# EasyEDA Pro project b6s.eprj, schematic Schematic2
Board Name: B5S_20A; Create Date: 2026-02-02; Page Name: P1; Project Name: b6s; Schematic Name: Schematic2; Update Date: 2026-02-08; Add into BOM: yes; Convert to PCB: yes
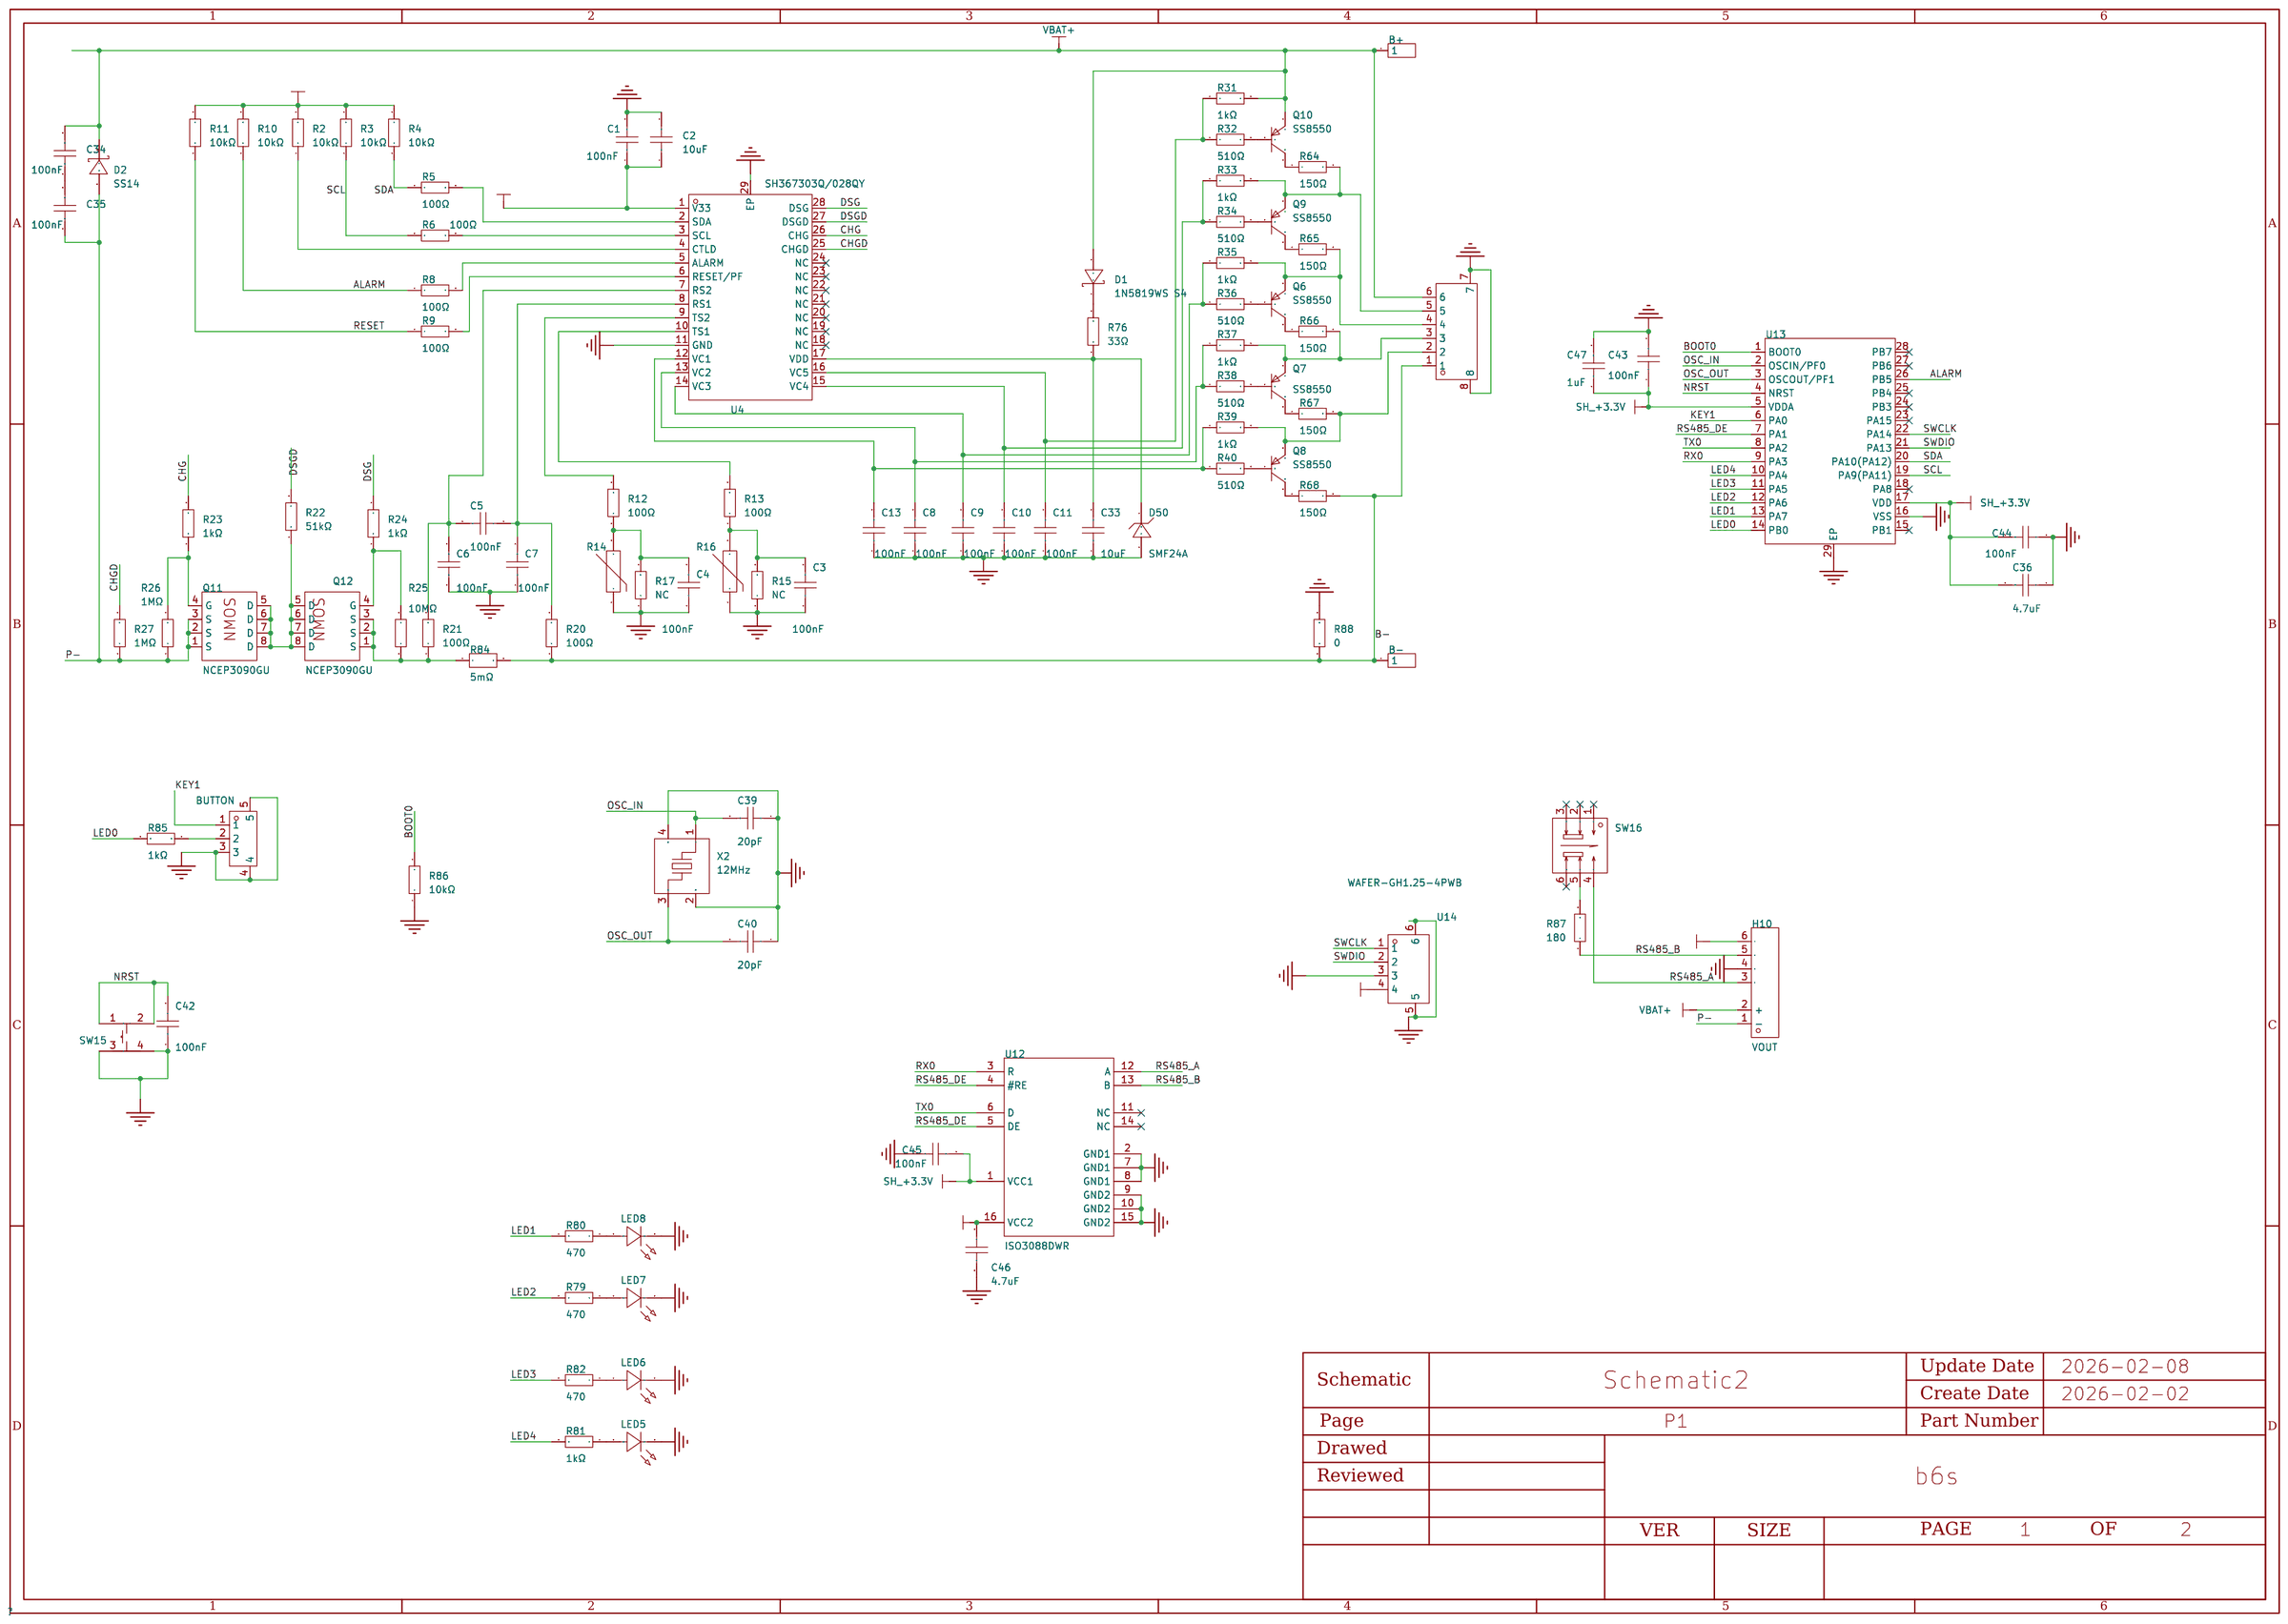
[diagram p1: schematic sheet]

## Parts
B+  -  [Wire_14AWG]
B-  -  [Wire_14AWG]
BUTTON  WAFER-GH1.25-3PLB  [CONN-SMD_3P-P1.25_XUNPU_WAFER-GH1.25-3PLB]
C1  100nF  [C0603]
C2  10uF  [C0603]
C3  100nF  [C0603]
C4  100nF  [C0603]
C5  100nF  [C0603]
C6  100nF  [C0603]
C7  100nF  [C0603]
C8  100nF  [C0603]
C9  100nF  [C0603]
C10  100nF  [C0603]
C11  100nF  [C0603]
C13  100nF  [C0603]
C33  10uF  [C0805]
C34  100nF  [C0603]
C35  100nF  [C0603]
C36  4.7uF  [C0603]
C39  20pF  [C0603]
C40  20pF  [C0603]
C42  100nF  [C0603]
C43  100nF  [C0603]
C44  100nF  [C0603]
C45  100nF  [C0603]
C46  4.7uF  [C0603]
C47  1uF  [C0603]
D1  1N5819WS S4  [SOD-323_L1.6-W1.3-LS2.7-RD]
D2  SS14  [SMA_L4.2-W2.6-LS5.0-RD_1]
D50  SMF24A  [SOD-123FL_L2.7-W1.8-LS3.8-RD]
H10  VOUT  [AMSS_XT60_2+4]
LED5  XL-257UBC-L  [LED-TH_L5.0-W2.5-P2.54-FD_GREEN_XL-257SYGD-L]
LED6  XL-257UBC-L  [LED-TH_L5.0-W2.5-P2.54-FD_GREEN_XL-257SYGD-L]
LED7  XL-257UBC-L  [LED-TH_L5.0-W2.5-P2.54-FD_GREEN_XL-257SYGD-L]
LED8  XL-257UBC-L  [LED-TH_L5.0-W2.5-P2.54-FD_GREEN_XL-257SYGD-L]
Q6  SS8550  [SOT-23-3_L2.9-W1.3-P1.90-LS2.4-BR]
Q7  SS8550  [SOT-23-3_L2.9-W1.3-P1.90-LS2.4-BR]
Q8  SS8550  [SOT-23-3_L2.9-W1.3-P1.90-LS2.4-BR]
Q9  SS8550  [SOT-23-3_L2.9-W1.3-P1.90-LS2.4-BR]
Q10  SS8550  [SOT-23-3_L2.9-W1.3-P1.90-LS2.4-BR]
Q11  NCEP3090GU  [DFN-8_L5.8-W4.9-P1.27-LS6.1-BL-2]
Q12  NCEP3090GU  [DFN-8_L5.8-W4.9-P1.27-LS6.1-BL-2]
R2  10kΩ  [R0603]
R3  10kΩ  [R0603]
R4  10kΩ  [R0603]
R5  100Ω  [R0603]
R6  100Ω  [R0603]
R8  100Ω  [R0603]
R9  100Ω  [R0603]
R10  10kΩ  [R0603]
R11  10kΩ  [R0603]
R12  100Ω  [R0603]
R13  100Ω  [R0603]
R14  MF52A103F3950 (A1)  [RES-TH_L2.5-W2.5-P1.70-D0.3]
R15  NC  [R0603]
R16  MF52A103F3950 (A1)  [RES-TH_L2.5-W2.5-P1.70-D0.3]
R17  NC  [R0603]
R20  100Ω  [R0603]
R21  100Ω  [R0603]
R22  51kΩ  [R0603]
R23  1kΩ  [R0603]
R24  1kΩ  [R0603]
R25  10MΩ  [R0603]
R26  1MΩ  [R0603]
R27  1MΩ  [R0603]
R31  1kΩ  [R0603]
R32  510Ω  [R0603]
R33  1kΩ  [R0603]
R34  510Ω  [R0603]
R35  1kΩ  [R0603]
R36  510Ω  [R0603]
R37  1kΩ  [R0603]
R38  510Ω  [R0603]
R39  1kΩ  [R0603]
R40  510Ω  [R0603]
R64  150Ω  [R1206]
R65  150Ω  [R1206]
R66  150Ω  [R1206]
R67  150Ω  [R1206]
R68  150Ω  [R1206]
R76  33Ω  [R0805]
R79  470  [R0603]
R80  470  [R0603]
R81  1kΩ  [R0603]
R82  470  [R0603]
R84  5mΩ  [R2512]
R85  1kΩ  [R0603]
R86  10kΩ  [R0603]
R87  180  [R0603]
R88  0  [R0603]
SW15  HX TS3425BA 250gf  [SW-SMD_4P-L4.2-W3.2-P2.15-LS4.6-1]
SW16  5.8 ZSGT  [SW-TH_5.8ZSGT]
U4  SH367303Q/028QY  [QFN-28_L5.0-W5.0-P0.50-TL-EP3.3]
U6  WAFER-GH1.25-6PLB  [CONN-SMD_6P-P1.25_XUNPU_WAFER-GH1.25-6PLB]
U12  ISO3088DWR  [SOIC-16_L10.3-W7.5-P1.27-LS10.3-BL]
U13  GD32E230G8U6TR  [QFN-28_L4.0-W4.0-P0.40-BL-EP2.8]
U14  WAFER-GH1.25-4PWB  [CONN-SMD_4P-P1.25_XUNPU_WAFER-GH1.25-4PWB]
X2  12MHz  [CRYSTAL-SMD_4P-L3.2-W2.5-BL]

## Library data of the parts
B+ B- = Wire_14AWG: Check: false
BUTTON = WAFER-GH1.25-3PLB: LCSC Part Name: 1x3P 间距:1.25mm 立贴 系列:GH; Supplier Part: C3029369; Manufacturer: XUNPU(讯普); Supplier Footprint: SMD,P=1.25mm; JLCPCB Part Class: 扩展库; Datasheet: https://item.szlcsc.com/datasheet/WAFER-GH1.25-3PLB/3561381.html; Supplier: LCSC; Pins Structure: 1x3P; Pitch: 1.25mm; Mounting Type: 立贴; Reference Series: GH; Number of Pins: 3P; Number of Rows: 1; Number of PINs Per Row: 3; Current Rating: 1A; Contact Material: 黄铜; Contact Plating: 锡; Operating Temperature: -25℃~+85℃; Voltage Rating: 125V; Plastic Material: LCP; Supplementary Features: 辅助焊脚; Color: 米色; Z-Height of the Board: 4.2mm; X-Length of Bottom Edge on Board (Spacing Line): 7mm; Y-Width of Bottom Edge on Board: 4.95mm
C1 C3-C11 C13 C34 C35 C42-C44 = CC0603KRX7R9BB104: LCSC Part Name: 100nF ±10% 50V; Supplier Part: C14663; Manufacturer: YAGEO(国巨); Supplier Footprint: 0603; JLCPCB Part Class: Basic Part; Datasheet: https://atta.szlcsc.com/upload/public/pdf/source/20180910/C282072_33301C7F631E79921B82A8DAC6BCC5B3.pdf; Supplier: LCSC; Tolerance: ±10%; Voltage Rated: 50V; Temperature Coefficient: X7R
C2 = CL10A106MP8NNNC: LCSC Part Name: 10uF ±20% 10V; Supplier Part: C85713; Manufacturer: SAMSUNG(三星); Supplier Footprint: 0603; JLCPCB Part Class: Extended Part; Datasheet: https://atta.szlcsc.com/upload/public/pdf/source/20160218/1457707763339.pdf; Supplier: LCSC; Tolerance: ±20%; Voltage Rated: 10V; Temperature Coefficient: X5R
C33 = CL21A225KBQNNNE: LCSC Part Name: 2.2uF ±10% 50V; Supplier Part: C377773; Manufacturer: SAMSUNG(三星); Supplier Footprint: 0805; JLCPCB Part Class: Basic Part; Datasheet: https://atta.szlcsc.com/upload/public/pdf/source/20160218/1457707763339.pdf; Supplier: LCSC; Tolerance: ±10%; Voltage Rated: 50V; Temperature Coefficient: X5R
C36 C47 = CL10A475KP8NNNC: LCSC Part Name: 4.7uF ±10% 10V; Supplier Part: C1705; Manufacturer: SAMSUNG(三星); Supplier Footprint: 0603; JLCPCB Part Class: Extended Part; Datasheet: https://atta.szlcsc.com/upload/public/pdf/source/20160218/1457707763339.pdf; Supplier: LCSC; Tolerance: ±10%; Voltage Rated: 10V; Temperature Coefficient: X5R; Check: true
C39 C40 C45 C46 = 0603CG200J500NT: LCSC Part Name: 20pF ±5% 50V; Supplier Part: C91702; Manufacturer: FH(风华); Supplier Footprint: 0603; JLCPCB Part Class: Extended Part; Datasheet: https://atta.szlcsc.com/upload/public/pdf/source/20200305/C486355_26A10D38EF8C2A5C37091D0039909270.pdf; Supplier: LCSC; Tolerance: ±5%; Voltage Rated: 50V; Temperature Coefficient: C0G; Type: 厚膜电阻; Power(Watts): 100mW; Overload Voltage (Max): 75V; Operating Temperature Range: -55℃~+155℃
D1 = 1N5819WS S4_C2927280: LCSC Part Name: 电压:40V 电流:350mA; Supplier Part: C2927280; Manufacturer: JSMSEMI(杰盛微); Supplier Footprint: SOD-323; JLCPCB Part Class: Extended Part; Datasheet: https://atta.szlcsc.com/upload/public/pdf/source/20240105/574E572B69D2DF1CD36E5C05FAB269C4.pdf; Supplier: LCSC; Diode Configuration: 独立式; Forward Voltage (Vf@If): 600mV@200mA; Reverse Voltage (Vr): 40V; Average Rectified Current (Io): 350mA; Reverse Leakage Current (Ir): 5uA@30V
D2 = SS14_C2480: 二极管配置:独立式;正向压降(Vf):550mV@1A;直流反向耐压(Vr):40V;整流电流:1A;; LCSC Part Name: 电压:40V 电流:1A; Supplier Part: C2480; Manufacturer: MDD(辰达半导体); Supplier Footprint: SMA(DO-214AC); JLCPCB Part Class: Basic Part; Datasheet: https://item.szlcsc.com/datasheet/SS14/2857.html; Supplier: LCSC; Diode Configuration: 独立式; Reverse Leakage Current (Ir): 300uA@40V; Voltage - Forward(Vf@If): 550mV@1A; Voltage - DC Reverse(Vr): 40V; Current - Rectified: 1A; Operating Junction Temperature Range: -55℃~+150℃; Non-Repetitive Peak Forward Surge Current: 25A
D50 = SMF24A_C726910: Supplier Part: C726910; Manufacturer: TWGMC(台湾迪嘉); Supplier Footprint: SOD-123FL; JLCPCB Part Class: Extended Part; Datasheet: https://atta.szlcsc.com/upload/public/pdf/source/20200825/C726891_B615A55314C94A3B16B7FBCD32D40567.pdf; Supplier: LCSC; Reverse Stand-Off Voltage (Vrwm): 22V; Maximum Clamping Voltage: 35.5V; Peak Pulse Current (Ipp)@10/1000us: 5.6A; Breakdown Voltage: 24.4V; Reverse Leakage Current (Ir): 1uA; Type: TVS
H10 = AMSS_XT60_2+4_fml: Check: false
LED5-LED8 = XL-257UBC-L: Supplier Part: C5440566; Manufacturer: XINGLIGHT(成兴光); Supplier Footprint: 插件,L=5mm; JLCPCB Part Class: 扩展库; Datasheet: https://atta.szlcsc.com/upload/public/pdf/source/20240218/40D0102E80711B0D8E9DC8314F36558B.pdf; Supplier: LCSC; Lamp Holder Type: 2*5*7mm方形灯头; Emitted Color: 蓝色; Forward Voltage (VF): 3V~3.4V; Power Dissipation: 80mW; Forward Current: 20mA; Dominant Wavelength: 465nm~470nm; Peak Wavelength: 468nm; Lens Color: 无色透明透镜; Luminous Intensity: 2000mcd; Viewing Angle: 35°; Operating Temperature: -25℃~+85℃
Q6-Q10 = SS8550_C7420371: LCSC Part Name: 耐压:25V 电流:1.5A PNP H档 200-350; Supplier Part: C7420371; Manufacturer: 宏迦橙; Supplier Footprint: SOT-23; JLCPCB Part Class: Extended Part; Datasheet: https://atta.szlcsc.com/upload/public/pdf/source/20231222/5BDA6DBF3A79C59009F81F0EEE6F8969.pdf; Supplier: LCSC; Transistor Type: PNP; Collector Current (Ic): 1.5A; Collector-Emitter Breakdown Voltage (Vceo): 25V; Power Dissipation (Pd): 300mW; DC Current Gain (hFE@Ic,Vce): 120@100mA,1.0V; Transition Frequency (fT): 100MHz; Collector Cut-Off Current (Icbo): 100nA; Collector-Emitter Saturation Voltage (VCE(sat)@Ic,Ib): 500mV@800mA,80mA; Operating Temperature: -55℃~+150℃
Q11 Q12 = NCEP3090GU: LCSC Part Name: 1个N沟道 耐压:30V 电流:90A; Supplier Part: C502967; Manufacturer: NCE(无锡新洁能); Supplier Footprint: DFN-8(4.9x5.8); JLCPCB Part Class: Extended Part; Datasheet: https://atta.szlcsc.com/upload/public/pdf/source/20201202/C502967_1009EB0823F10C8B4E6881BA39DB5D87.pdf; Supplier: LCSC; Type: 1个N沟道; Drain Source Voltage (Vdss): 30V; Continuous Drain Current (Id): 90A; Power Dissipation (Pd): 70W; Drain Source On Resistance (RDS(on)@Vgs,Id): 2mΩ@10V,20A; Gate Threshold Voltage (Vgs(th)@Id): 1.5V@250uA; Total Gate Charge (Qg@Vgs): 34.8nC@10V; Input Capacitance (Ciss@Vds): 2.1nF@15V; Reverse Transfer Capacitance (Crss@Vds): 15.5pF@15V; Operating Temperature: -55℃~+150℃@(Tj)
R2-R4 R10 R11 = FRC0603J103TS: LCSC Part Name: 10kΩ ±5% 100mW 厚膜电阻; Supplier Part: C2930027; Manufacturer: FOJAN(富捷); Supplier Footprint: 0603; JLCPCB Part Class: Extended Part; Datasheet: https://atta.szlcsc.com/upload/public/pdf/source/20211221/925EC7D7225764EE0046F22065062C87.pdf; Supplier: LCSC; Type: 厚膜电阻; Tolerance: ±5%; Power(Watts): 100mW; Overload Voltage (Max): 75V; Temperature Coefficient: ±100ppm/℃; Operating Temperature Range: -55℃~+155℃
R5 R6 R8 R9 R12 R13 R20 R21 = RC0603FR-07100RL: LCSC Part Name: 厚膜电阻 100Ω ±1% 100mW; Supplier Part: C105588; Manufacturer: YAGEO(国巨); Supplier Footprint: 0603; JLCPCB Part Class: Extended Part; Datasheet: https://atta.szlcsc.com/upload/public/pdf/source/20180316/70C0E2BDAE7FCC62C531A5A58D202EE1.pdf; Supplier: LCSC; Type: 厚膜电阻; Tolerance: ±1%; Power(Watts): 100mW; Overload Voltage (Max): 75V; Temperature Coefficient: ±100ppm/℃; Operating Temperature Range: -55℃~+155℃
R14 R16 = MF52A103F3950 (A1): LCSC Part Name: 10kΩ 电阻精度:±1% 3950K; Supplier Part: C13879; Manufacturer: 时恒; Supplier Footprint: 插件,P=1.7mm; JLCPCB Part Class: 扩展库; Datasheet: https://atta.szlcsc.com/upload/public/pdf/source/20181018/C324070_6015F64EA824A635FDB9BBFA1E1FD5FE.pdf; Supplier: LCSC; Resistance @ 25℃: 10kΩ; B Constant (25℃/50℃): 3950K; Resistance Tolerance: ±1%; Power: 50mW; B Constant Tolerance: ±1%; Operating Temperature: -55℃~+125℃
R15 R17 = Res_0603: Supplier Footprint: 0603; Check: false
R22-R24 R31 R33 R35 R37 R39 R79-R82 R85 R86 = FRC0603J102 TS: LCSC Part Name: 1kΩ ±5% 100mW 厚膜电阻; Supplier Part: C2907113; Manufacturer: FOJAN(富捷); Supplier Footprint: 0603; JLCPCB Part Class: Extended Part; Datasheet: https://atta.szlcsc.com/upload/public/pdf/source/20211221/925EC7D7225764EE0046F22065062C87.pdf; Supplier: LCSC; Type: 厚膜电阻; Tolerance: ±5%; Power(Watts): 100mW; Overload Voltage (Max): 75V; Temperature Coefficient: ±100ppm/℃; Operating Temperature Range: -55℃~+155℃
R25 = 0603WAJ0106T5E: LCSC Part Name: 10MΩ ±5% 100mW 厚膜电阻; Supplier Part: C26097; Manufacturer: UNI-ROYAL(厚声); Supplier Footprint: 0603; JLCPCB Part Class: Extended Part; Datasheet: https://atta.szlcsc.com/upload/public/pdf/source/20200306/C422600_1E6D84923E4A46A82E41ADD87F860B5C.pdf; Supplier: LCSC; Type: 厚膜电阻; Tolerance: ±5%; Power(Watts): 100mW; Overload Voltage (Max): 75V; Temperature Coefficient: ±100ppm/℃; Operating Temperature Range: -55℃~+155℃
R26 R27 = 0603WAJ0105T5E: LCSC Part Name: 1MΩ ±5% 100mW 厚膜电阻; Supplier Part: C26098; Manufacturer: UNI-ROYAL(厚声); Supplier Footprint: 0603; JLCPCB Part Class: Extended Part; Datasheet: https://atta.szlcsc.com/upload/public/pdf/source/20200306/C422600_1E6D84923E4A46A82E41ADD87F860B5C.pdf; Supplier: LCSC; Type: 厚膜电阻; Tolerance: ±5%; Power(Watts): 100mW; Overload Voltage (Max): 75V; Temperature Coefficient: ±100ppm/℃; Operating Temperature Range: -55℃~+155℃
R32 R34 R36 R38 R40 = FRC0603J511 TS: LCSC Part Name: 510Ω ±5% 100mW 厚膜电阻; Supplier Part: C2907179; Manufacturer: FOJAN(富捷); Supplier Footprint: 0603; JLCPCB Part Class: Extended Part; Datasheet: https://atta.szlcsc.com/upload/public/pdf/source/20211221/925EC7D7225764EE0046F22065062C87.pdf; Supplier: LCSC; Type: 厚膜电阻; Tolerance: ±5%; Power(Watts): 100mW; Overload Voltage (Max): 75V; Temperature Coefficient: ±100ppm/℃; Operating Temperature Range: -55℃~+155℃
R64-R68 = FRC1206J151 TS: LCSC Part Name: 150Ω ±5% 250mW 厚膜电阻; Supplier Part: C2907432; Manufacturer: FOJAN(富捷); Supplier Footprint: 1206; JLCPCB Part Class: Extended Part; Datasheet: https://atta.szlcsc.com/upload/public/pdf/source/20211221/925EC7D7225764EE0046F22065062C87.pdf; Supplier: LCSC; Type: 厚膜电阻; Tolerance: ±5%; Power(Watts): 250mW; Overload Voltage (Max): 200V; Temperature Coefficient: ±100ppm/℃; Operating Temperature Range: -55℃~+155℃
R76 = 0805W8F510JT5E: LCSC Part Name: 51Ω ±1% 125mW 厚膜电阻; Supplier Part: C17738; Manufacturer: UNI-ROYAL(厚声); Supplier Footprint: 0805; JLCPCB Part Class: 基础库; Datasheet: https://atta.szlcsc.com/upload/public/pdf/source/20200306/C422600_1E6D84923E4A46A82E41ADD87F860B5C.pdf; Supplier: LCSC; Type: 厚膜电阻; Tolerance: ±1%; Power(Watts): 125mW; Overload Voltage (Max): 150V; Temperature Coefficient: ±100ppm/℃; Operating Temperature Range: -55℃~+155℃
R84 = JER2512F3R005: LCSC Part Name: 5mΩ 3W 2512 ±1%; Supplier Part: C46634460; Manufacturer: JIERR(捷而瑞); Supplier Footprint: 2512; JLCPCB Part Class: 扩展库; Datasheet: https://item.szlcsc.com/datasheet/JER2512F3R005/48788262.html; Supplier: LCSC; Type: 采样电阻；合金电阻; Tolerance: ±1%; Power(Watts): 3W; Temperature Coefficient: ±50ppm/℃
R87 R88 = Res_0603: Supplier Footprint: 0603
SW15 = HX TS3425BA 250gf: LCSC Part Name: 4.2*3.4*2.5mm 立贴 轻触开关; Supplier Part: C5143626; Manufacturer: hanxia(韩下); Supplier Footprint: SMD; JLCPCB Part Class: Extended Part; Datasheet: https://atta.szlcsc.com/upload/public/pdf/source/20220824/1A14C87ED744C5EEF64F014B8B111430.pdf; Supplier: LCSC; Circuit: 单刀单掷; Operating Force: 250gf; Mounting Style: 立贴; Switch Length: 4.2mm; Switch Width: 3.4mm; Switch Height: 2.5mm; Contact Current: 50mA; Voltage Rating (DC): 12V; Insulation Resistance: 100MΩ; Actuator/Cap Color: 白色; With Lamp: 无; Pin Style: SMD接片; Mechanical Life: 10万次; Operating Temperature: -20℃~+85℃; Actuator Style: 椭圆形按钮; Strike Gundam: 不带
SW16 = 5.8 ZSGT: LCSC Part Name: 5.8*5.8有头/高头 带锁/自锁开关 泡泡机开关; Supplier Part: C2681587; Manufacturer: SHOU HAN(首韩); Supplier Footprint: 插件; JLCPCB Part Class: 扩展库; Datasheet: https://item.szlcsc.com/datasheet/5.8%2520ZSGT/2774930.html; Supplier: LCSC; Circuit: 双刀双掷; Self Lock / No Lock: 自锁; Actuator Style: 方形按钮; Mounting Type: 直插; Contact Current: 110mA; Voltage Rating: 30V; Actuator/Cap Color: 白色; With Lamp: 不带; Termination Style: PC引脚; Operating Force: 1.5N; Operating Temperature: -10℃~+70℃; Life: 10万次
U4 = SH367303Q/028QY: Supplier Part: C2839013; Supplier Footprint: QFN-28-EP(5x5); JLCPCB Part Class: 扩展库; Datasheet: https://atta.szlcsc.com/upload/public/pdf/source/20211010/C2839013_F8EB19FBD6B2929B0C20591E4E1EC47D.pdf; Supplier: LCSC
U6 = WAFER-GH1.25-6PLB: LCSC Part Name: 1x6P 间距:1.25mm 立贴 系列:GH; Supplier Part: C3029372; Manufacturer: XUNPU(讯普); Supplier Footprint: SMD,P=1.25mm; JLCPCB Part Class: Extended Part; Datasheet: https://atta.szlcsc.com/upload/public/pdf/source/20220527/44F824AAC8C2B617205E15955FF9C23D.pdf; Supplier: LCSC; Pins Structure: 1x6P; Pitch: 1.25mm; Mounting Style: 立贴; Reference Series: GH; Number of Pins: 6P; Number of Rows: 1; Number of PINs Per Row: 6; Current Rating (Max): 1A; Operating Temperature Range: -25℃~+85℃
U12 = ISO3088DWR: LCSC Part Name: 3.15V~5.5V供电 20Mbps 收发器; Supplier Part: C39386; Manufacturer: TI(德州仪器); Supplier Footprint: SOIC-16-300mil; JLCPCB Part Class: 扩展库; Datasheet: https://www.ti.com/cn/lit/gpn/iso3088; Supplier: LCSC; Data Rate(Max): 20Mbps; Operating Temperature: -40℃~+85℃
U13 = GD32E230G8U6TR: LCSC Part Name: ARM Cortex-M23 32位微控制器（MCU）; Supplier Part: C380534; Manufacturer: GigaDevice(兆易创新); Supplier Footprint: QFN-28-EP(4x4); JLCPCB Part Class: 扩展库; Datasheet: https://item.szlcsc.com/datasheet/GD32E230G8U6TR/352854.html; Supplier: LCSC; CPU Core: ARM Cortex-M系列; CPU Maximum Speed: 72MHz; Program Storage Size: 64KB; Program Memory Type: FLASH; Number of I/O: 23; ADC (Bit): 12bit; Voltage - Supply: 1.8V~3.6V
U14 = WAFER-GH1.25-4PWB: LCSC Part Name: 1x4P 间距:1.25mm 卧贴 系列:GH; Supplier Part: C3029379; Manufacturer: XUNPU(讯普); Supplier Footprint: SMD,P=1.25mm,卧贴; JLCPCB Part Class: 扩展库; Datasheet: https://item.szlcsc.com/datasheet/WAFER-GH1.25-4PWB/3561391.html; Supplier: LCSC; Pins Structure: 1x4P; Pitch: 1.25mm; Mounting Type: 卧贴; Reference Series: GH; Number of Pins: 4P; Number of Rows: 1; Number of PINs Per Row: 4; Current Rating: 1A; Contact Material: 黄铜; Contact Plating: 锡; Operating Temperature: -25℃~+85℃; Voltage Rating: 125V; Plastic Material: LCP; Supplementary Features: 辅助焊脚; Color: 米色; Z-Height of the Board: 4.35mm; X-Length of Bottom Edge on Board (Spacing Line): 8.25mm; Y-Width of Bottom Edge on Board: 5mm
X2 = X322512MSB4SI: 晶振类型:贴片晶振;频率:12MHz;常温频差:±10ppm;负载电容:20pF;频率稳定度:±20ppm;; LCSC Part Name: YSX321SL 12MHZ 4P 3225 20PF ±10PPM -40~85℃ (±20PPM); Supplier Part: C9002; Manufacturer: YXC(扬兴晶振); Supplier Footprint: SMD3225-4P; JLCPCB Part Class: Basic Part; Datasheet: https://item.szlcsc.com/datasheet/X322512MSB4SI/9522.html; Supplier: LCSC; Normal temperature Frequency Tolerance: ±10ppm; Operating Temperature: -40℃~+85℃; Type: 贴片晶振; Load Capacitance: 20pF; Frequency Stability: ±20ppm; Crystal Type: 贴片晶振; External load capacitor: 20pF; Frequency Stability(Full temperature range): ±20ppm; Frequency Tolerance: ±20ppm

## Nets
GND: BUTTON.3 BUTTON.4 BUTTON.5 C1.2 C2.2 C3.1 C4.1 C6.1 C7.1 C8.1 C9.1 C10.1 C11.1 C13.1 C33.1 C36.1 C39.1 C40.1 C42.1 C43.2 C44.2 C45.1 C47.2 D50.2(A) LED5.2(K) LED6.2(K) LED7.2(K) LED8.2(K) R14.1 R15.1 R16.1 R17.1 R86.1 R88.2 SW15.3 SW15.4 U4.11(GND) U4.29(EP) U6.7 U6.8 U12.2(GND1) U12.7(GND1) U12.8(GND1) U13.16(VSS) U13.29(EP) U14.3 U14.5 U14.6 X2.2(GND) X2.4(GND)
GND2: C46.2 H10.4(+) U12.9(GND2) U12.10(GND2) U12.15(GND2)
VBAT+: B+.1 C34.2 D1.2(A) D2.1(K) H10.2(+) Q10.2(E) R31.2 U6.6
VCC2: C46.1 H10.6(+) U12.16(VCC2)
ALARM: R8.1 R10.1 U13.26(PB5)
B-: B-.1 R20.1 R68.2 R84.2 R88.1 U6.1
BOOT0: R86.2 U13.1(BOOT0)
CHG: R23.2 U4.26(CHG)
CHGD: R27.2 U4.25(CHGD)
DSG: R24.2 U4.28(DSG)
DSGD: R22.2 U4.27(DSGD)
KEY1: BUTTON.1 U13.6(PA0)
LED0: R85.1 U13.14(PB0)
LED1: R80.2 U13.13(PA7)
LED2: R79.2 U13.12(PA6)
LED3: R82.2 U13.11(PA5)
LED4: R81.2 U13.10(PA4)
NRST: C42.2 SW15.1 SW15.2 U13.4(NRST)
OSC_IN: C39.2 U13.2(OSCIN/PF0) X2.1
OSC_OUT: C40.2 U13.3(OSCOUT/PF1) X2.3
P-: C35.1 D2.2(A) H10.1(-) Q11.1(S) Q11.2(S) Q11.3(S) R26.1 R27.1
RESET: R9.1 R11.1
RS485_A: H10.3(+) SW16.4 U12.12(A)
RS485_B: H10.5(+) R87.1 U12.13(B)
RS485_DE: U12.4(#RE) U12.5(DE) U13.7(PA1)
RX0: U12.3(R) U13.9(PA3)
SCL: R3.1 R6.1 U13.19(PA9(PA11))
SDA: R4.1 R5.1 U13.20(PA10(PA12))
SH_+3.3V: C1.1 C2.1 C36.2 C43.1 C44.1 C45.2 C47.1 R2.2 R3.2 R4.2 R10.2 R11.2 U4.1(V33) U12.1(VCC1) U13.5(VDDA) U13.17(VDD) U14.4
SWCLK: U13.22(PA14) U14.1
SWDIO: U13.21(PA13) U14.2
TX0: U12.6(D) U13.8(PA2)
$1N5331: Q7.2(E) R37.2 R66.2 U6.3
$1N5332: Q8.2(E) R39.2 R67.2 U6.2
$1N5333: Q6.2(E) R35.2 R65.2 U6.4
$1N5334: Q9.2(E) R33.2 R64.2 U6.5
$1N5338: Q8.3(C) R68.1
$1N5339: Q6.1(B) R36.2
$1N5340: Q6.3(C) R66.1
$1N5341: Q7.3(C) R67.1
$1N5342: D1.1(K) R76.2
$1N5343: C33.2 D50.1(C) R76.1 U4.17(VDD)
$1N5344: Q7.1(B) R38.2
$1N5345: C9.2 R35.1 R36.1 U4.14(VC3)
$1N5346: C8.2 R37.1 R38.1 U4.13(VC2)
$1N5347: Q8.1(B) R40.2
$1N5348: C13.2 R39.1 R40.1 U4.12(VC1)
$1N5350: Q10.3(C) R64.1
$1N5351: Q9.3(C) R65.1
$1N5352: Q9.1(B) R34.2
$1N5355: C10.2 R33.1 R34.1 U4.15(VC4)
$1N5356: C11.2 R31.1 R32.1 U4.16(VC5)
$1N5358: Q10.1(B) R32.2
$1N5363: Q11.5(D) Q11.6(D) Q11.7(D) Q11.8(D) Q12.5(D) Q12.6(D) Q12.7(D) Q12.8(D) R22.1
$1N5388: Q11.4(G) R23.1 R26.2
$1N5396: R2.1 U4.4(CTLD)
$1N5444: Q12.1(S) Q12.2(S) Q12.3(S) R21.1 R25.1 R84.1
$1N5445: C4.2 R12.1 R14.2 R17.2
$1N5447: R13.2 U4.10(TS1)
$1N5448: R12.2 U4.9(TS2)
$1N5450: C5.2 C6.2 R21.2 U4.7(RS2)
$1N5451: C5.1 C7.2 R20.2 U4.8(RS1)
$1N5452: Q12.4(G) R24.1 R25.2
$1N5456: R6.2 U4.3(SCL)
$1N5457: R8.2 U4.5(ALARM)
$1N5458: R9.2 U4.6(RESET/PF)
$1N5459: R5.2 U4.2(SDA)
$1N5466: C3.2 R13.1 R15.2 R16.2
$1N5477: C34.1 C35.2
$1N29511: LED5.1(A) R81.1
$1N29512: LED6.1(A) R82.1
$1N29517: LED7.1(A) R79.1
$1N29518: LED8.1(A) R80.1
$1N33094: BUTTON.2 R85.2
$1N36982: R87.2 SW16.5

Not connected (* = marked no-connect by the designer): SW16 1* 2* 3* 6*; U4 18(NC)* 19(NC)* 20(NC)* 21(NC)* 22(NC)* 23(NC)* 24(NC)*; U12 11(NC)* 14(NC)*; U13 15(PB1)* 18(PA8)* 23(PA15)* 24(PB3)* 25(PB4)* 27(PB6)* 28(PB7)*
